# Altium schematic sheet E17-15-Buttons.SchDoc
size A; DocumentNumber: 6; SheetNumber: 6; SheetTotal: 9
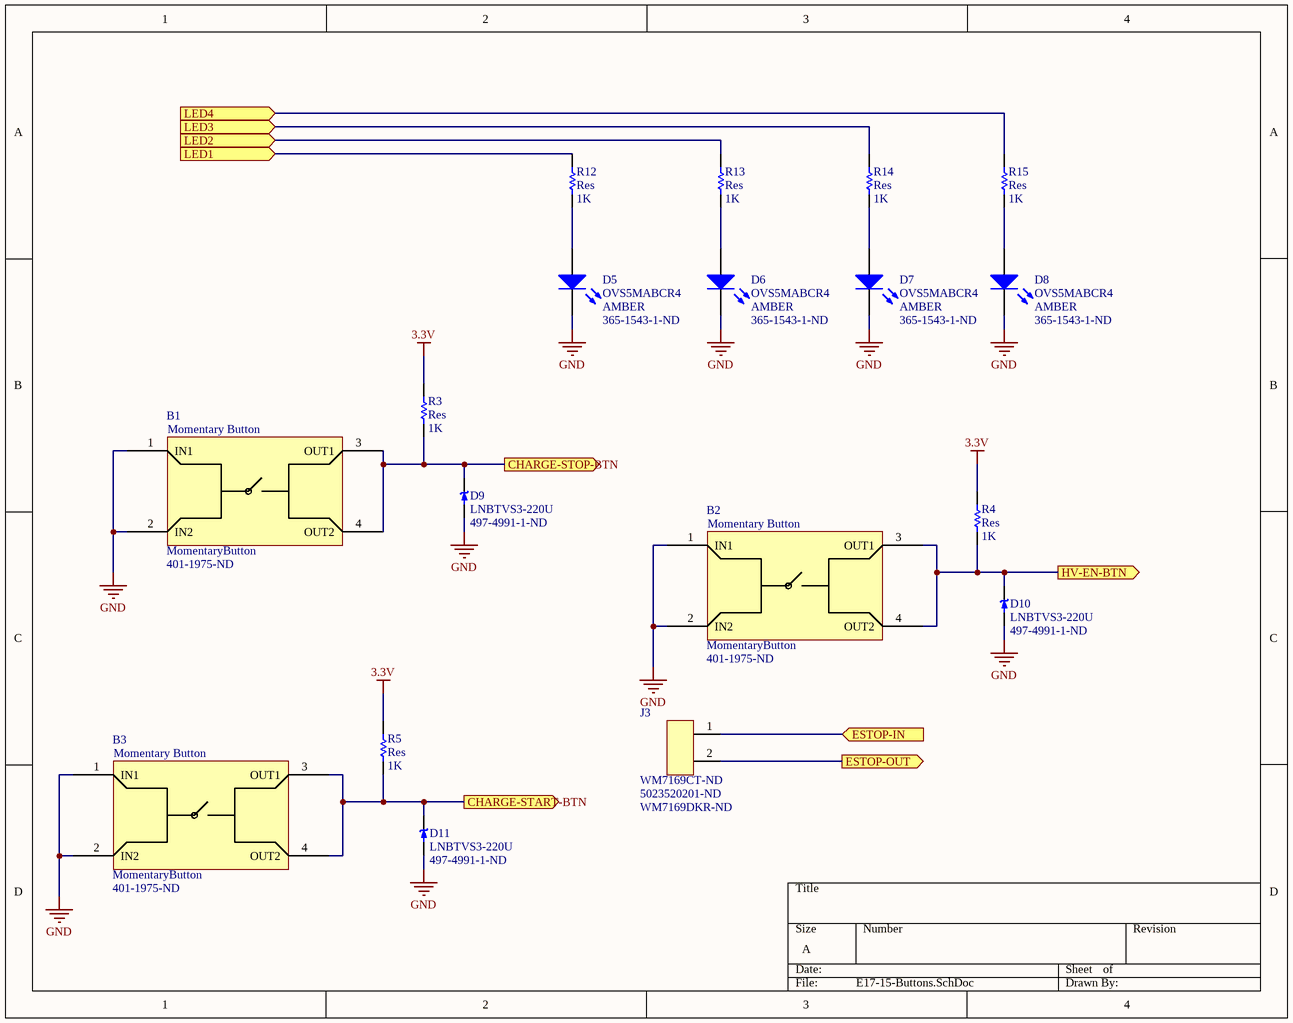
[diagram p0: E17-15-Buttons.SchDoc]

## Parts
B1  MomentaryButton  DigiKey Part Number: 401-1975-ND  [MomentaryButton]
B2  MomentaryButton  DigiKey Part Number: 401-1975-ND  [MomentaryButton]
B3  MomentaryButton  DigiKey Part Number: 401-1975-ND  [MomentaryButton]
D5  OVS5MABCR4  Colour: AMBER  Supplier Part Number 1: 365-1543-1-ND  [OVS5MABCR4]
D6  OVS5MABCR4  Colour: AMBER  Supplier Part Number 1: 365-1543-1-ND  [OVS5MABCR4]
D7  OVS5MABCR4  Colour: AMBER  Supplier Part Number 1: 365-1543-1-ND  [OVS5MABCR4]
D8  OVS5MABCR4  Colour: AMBER  Supplier Part Number 1: 365-1543-1-ND  [OVS5MABCR4]
D9  LNBTVS3-220U  Supplier Part Number 1: 497-4991-1-ND  [DO-214-AA]
D10  LNBTVS3-220U  Supplier Part Number 1: 497-4991-1-ND  [DO-214-AA]
D11  LNBTVS3-220U  Supplier Part Number 1: 497-4991-1-ND  [DO-214-AA]
J3  Supplier Part Number 1: 5023520201-ND  Supplier Part Number 2: WM7169DKR-ND  [MOLEX_DURACLIK_2]  (hidden comment: J_5023520200)
R3  Res  value 1K  [2012[0805]]
R4  Res  value 1K  [2012[0805]]
R5  Res  value 1K  [2012[0805]]
R12  Res  value 1K  [3216[1206]]
R13  Res  value 1K  [3216[1206]]
R14  Res  value 1K  [3216[1206]]
R15  Res  value 1K  [3216[1206]]

## Ports
CHARGE-START-BTN (out), CHARGE-STOP-BTN (out), ESTOP-IN (in), ESTOP-OUT (out), HV-EN-BTN (out), LED1 (in), LED2 (in), LED3 (in), LED4 (in)

## Nets
3.3V: R3.2 R4.2 R5.2
GND: B1.1(IN1) B1.2(IN2) B2.1(IN1) B2.2(IN2) B3.1(IN1) B3.2(IN2) D5.2(K) D6.2(K) D7.2(K) D8.2(K) D9.1 D10.1 D11.1
CHARGE-START-BTN: B3.3(OUT1) B3.4(OUT2) D11.2 R5.1 ; port CHARGE-START-BTN
CHARGE-STOP-BTN: B1.3(OUT1) B1.4(OUT2) D9.2 R3.1 ; port CHARGE-STOP-BTN
ESTOP-IN: J3.1 ; port ESTOP-IN
ESTOP-OUT: J3.2 ; port ESTOP-OUT
HV-EN-BTN: B2.3(OUT1) B2.4(OUT2) D10.2 R4.1 ; port HV-EN-BTN
LED1: R12.1 ; port LED1
LED2: R13.1 ; port LED2
LED3: R14.1 ; port LED3
LED4: R15.1 ; port LED4
NetD5_1: D5.1(A) R12.2
NetD6_1: D6.1(A) R13.2
NetD7_1: D7.1(A) R14.2
NetD8_1: D8.1(A) R15.2

## Notes on the sheet
- (in symbol MomentaryButton) Momentary Button

## Library data of the parts
D5-D8 = OVS5MABCR4: Typical AMBER LED; Published: 8-Jun-2000; LatestRevisionDate: 17-Jul-2002; LatestRevisionNote: Re-released for DXP Platform.; PackageDocument: Feb-2002; PackageReference: 3.2X1.6X1.1; Publisher: Altium Limited; Supplier 1: Digi-Key
D9-D11 = LNBTVS3-220U: TVS DIODE 20VWM 35VC SMB; Supplier 1: Digi-Key
J3 = J_5023520200: MOLEX DURACLIK 2-PIN RA; Digikey_PN: WM7169CT-ND; Supplier 1: Digi-Key; Supplier 2: Digi-Key
R3-R5 R12-R15 = Res: Surface Mount Resistor; Published: 8-Jun-2000; LatestRevisionDate: 17-Jul-2002; LatestRevisionNote: Re-released for DXP Platform.; PackageReference: AXIAL-0.5; Publisher: Altium Limited